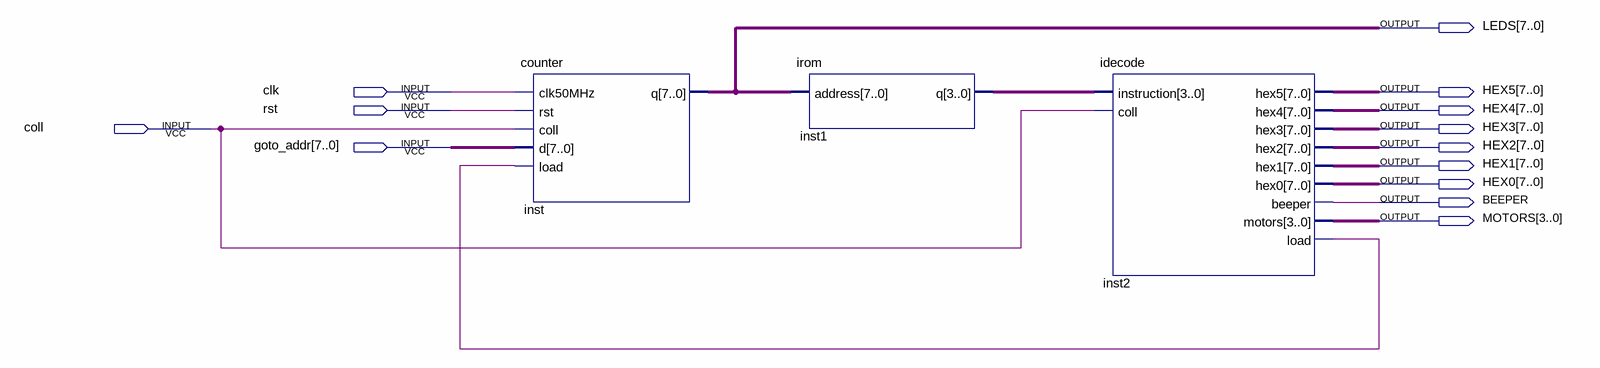
[diagram p0: schematic sheet]
// Quartus schematic lab8.bdf as structural Verilog: 3 symbols, 13 pins
module lab8 (
  input  clk,
  input  rst,
  input  coll,
  input  [7:0] goto_addr,
  output [7:0] LEDS,
  output [7:0] HEX5,
  output [7:0] HEX4,
  output [7:0] HEX3,
  output [7:0] HEX2,
  output [7:0] HEX1,
  output [7:0] HEX0,
  output BEEPER,
  output [3:0] MOTORS
);

  wire inst2_load;
  wire [3:0] inst1_q;

  counter inst (.clk50MHz(clk), .rst(rst), .coll(coll), .d(goto_addr), .load(inst2_load), .q(LEDS));
  irom inst1 (.address(LEDS), .q(inst1_q));
  idecode inst2 (
    .instruction(inst1_q), .coll(coll), .hex5(HEX5), .hex4(HEX4), .hex3(HEX3), .hex2(HEX2), .hex1(HEX1),
    .hex0(HEX0), .beeper(BEEPER), .motors(MOTORS), .load(inst2_load));
endmodule
